# EAGLE design master-sim800-esp32-30pin (EAGLE 9.6.2)
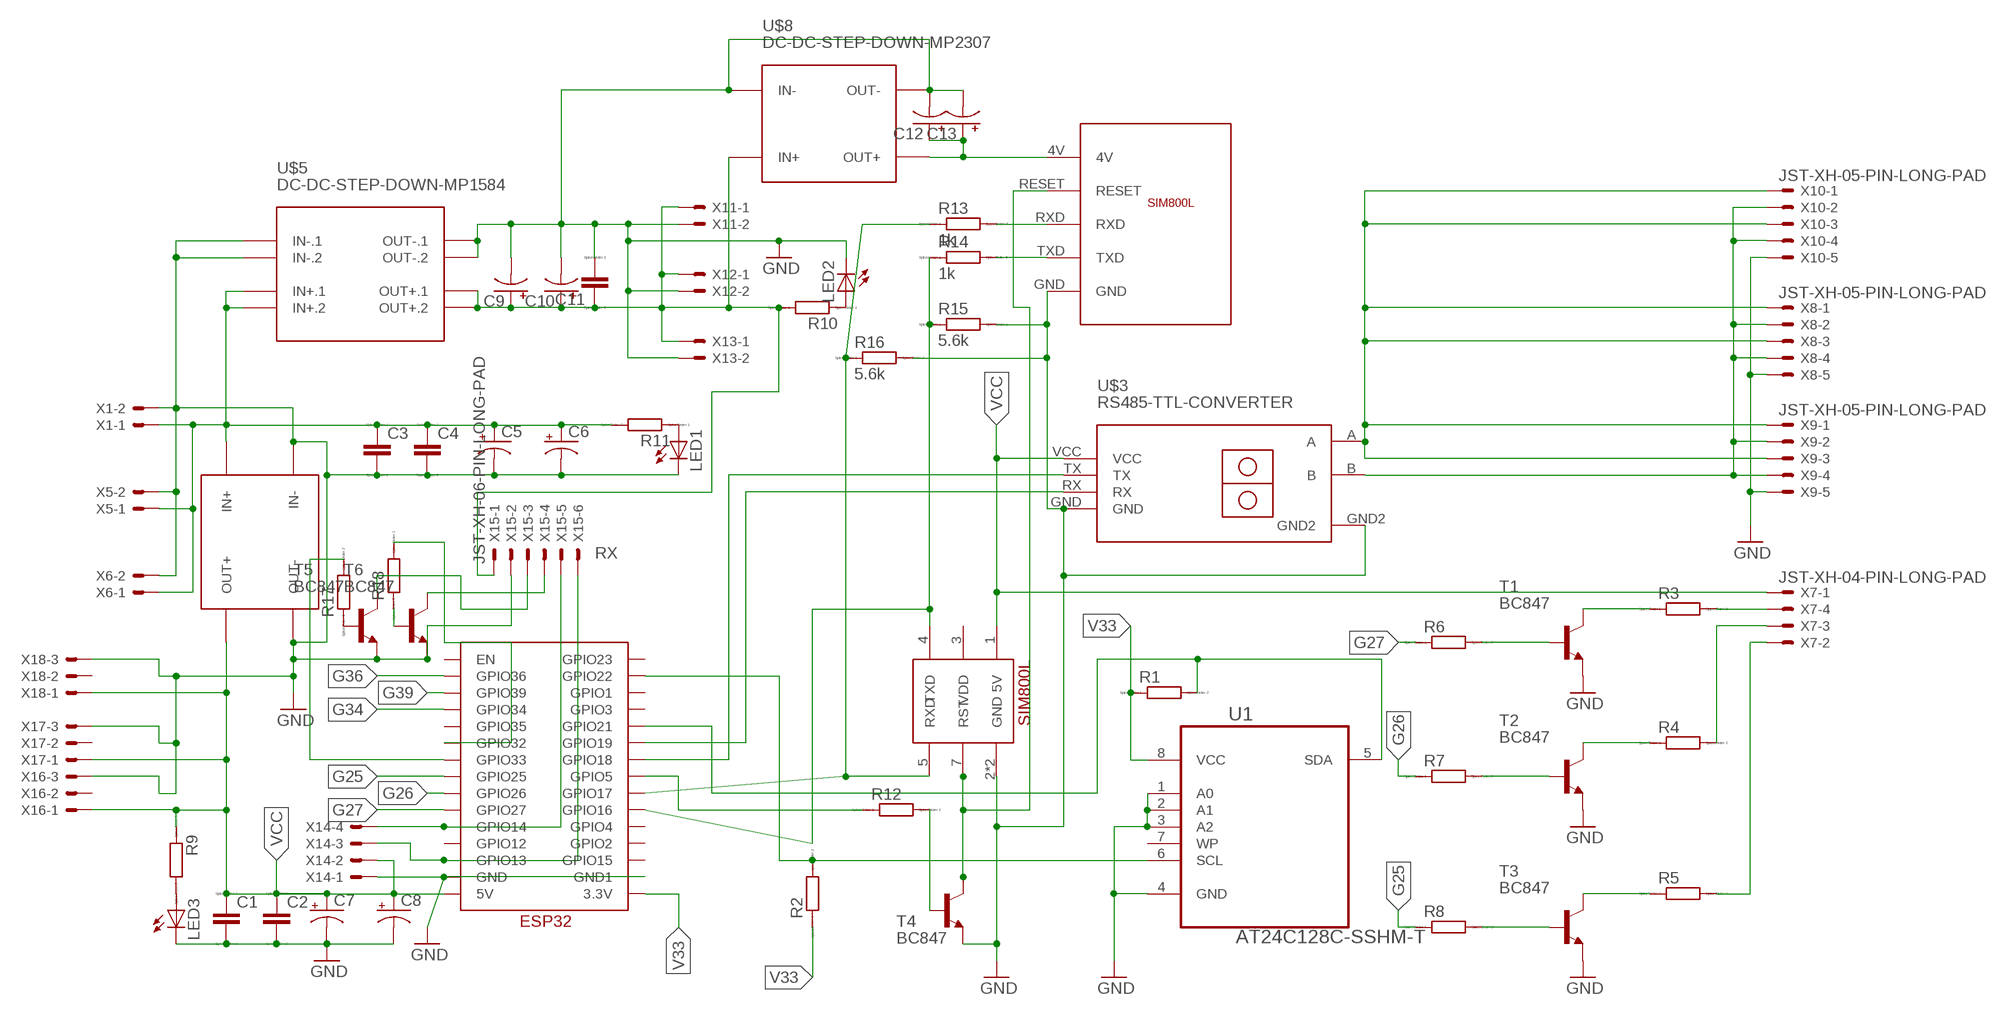
[diagram p0: schematic, sheet 1]

## Parts
C1  C  [C0805]
C2  C  [C0805]
C3  C  [C0805]
C4  C  [C0805]
C5  CPOL-USE5-8.5  [E5-8,5]
C6  CPOL-USE5-8.5  [E5-8,5]
C7  CPOL-USE5-8.5  [E5-8,5]
C8  CPOL-USE5-8.5  [E5-8,5]
C9  CPOL-USE5-6  [E5-6]
C10  CPOL-USE5-6  [E5-6]
C11  C  [C0805]
C12  CPOL-USE5-8.5  [E5-8,5]
C13  CPOL-USE5-8.5  [E5-8,5]
LED1  LEDCHIPLED_1206  [CHIPLED_1206]
LED2  LEDCHIPLED_1206  [CHIPLED_1206]
LED3  LEDCHIPLED_1206  [CHIPLED_1206]
R1  RR1206  [R1206]
R2  RR1206  [R1206]
R3  RR1206  [R1206]
R4  RR1206  [R1206]
R5  RR1206  [R1206]
R6  RR1206  [R1206]
R7  RR1206  [R1206]
R8  RR1206  [R1206]
R9  RR1206  [R1206]
R10  RR1206  [R1206]
R11  RR1206  [R1206]
R12  RR1206  [R1206]
R13  1k  RR1206  [R1206]
R14  1k  RR1206  [R1206]
R15  5.6k  RR1206  [R1206]
R16  5.6k  RR1206  [R1206]
R17  RR1206  [R1206]
R18  RR1206  [R1206]
T1  BC847  [SOT23]
T2  BC847  [SOT23]
T3  BC847  [SOT23]
T4  BC847  [SOT23]
T5  BC847  [SOT23]
T6  BC847  [SOT23]
U1  AT24C128C-SSHM-T  [SOIC127P600X175-8N]
U$1  ESP32-30PIN  [ESP32-30PIN]
U$2  SIM800L  [SIP]
U$3  RS485-TTL-CONVERTER  [RS485-TTL-CONVERTER]
U$4  DC-DC-STEP-DOWN-MP2307  [DC-DC-STEP-DOWN-MP2307]
U$5  DC-DC-STEP-DOWN-MP1584  [DC-DC-STEP-DOWN-MP1584]
U$7  SIM800L-V1  [SIM800L]
U$8  DC-DC-STEP-DOWN-MP2307  [DC-DC-STEP-DOWN-MP2307]
X1  JST-XH-02-PIN-LONG-PAD  [JST-XH-02-PACKAGE-LONG-PAD]
X5  JST-XH-02-PIN-LONG-PAD  [JST-XH-02-PACKAGE-LONG-PAD]
X6  JST-XH-02-PIN-LONG-PAD  [JST-XH-02-PACKAGE-LONG-PAD]
X7  JST-XH-04-PIN-LONG-PAD  [JST-XH-04-PACKAGE-LONG-PAD]
X8  JST-XH-05-PIN-LONG-PAD  [JST-XH-05-PACKAGE-LONG-PAD]
X9  JST-XH-05-PIN-LONG-PAD  [JST-XH-05-PACKAGE-LONG-PAD]
X10  JST-XH-05-PIN-LONG-PAD  [JST-XH-05-PACKAGE-LONG-PAD]
X11  JST-XH-02-PIN-LONG-PAD  [JST-XH-02-PACKAGE-LONG-PAD]
X12  JST-XH-02-PIN-LONG-PAD  [JST-XH-02-PACKAGE-LONG-PAD]
X13  JST-XH-02-PIN-LONG-PAD  [JST-XH-02-PACKAGE-LONG-PAD]
X14  JST-XH-04-PIN-LONG-PAD  [JST-XH-04-PACKAGE-LONG-PAD]
X15  JST-XH-06-PIN-LONG-PAD  [JST-XH-06-PACKAGE-LONG-PAD]
X16  JST-XH-03-PIN-LONG-PAD  [JST-XH-03-PACKAGE-LONG-PAD]
X17  JST-XH-03-PIN-LONG-PAD  [JST-XH-03-PACKAGE-LONG-PAD]
X18  JST-XH-03-PIN-LONG-PAD  [JST-XH-03-PACKAGE-LONG-PAD]

## Nets
G25: R8.1 U$1.GPIO25
G26: R7.1 U$1.GPIO26
G27: R6.1 U$1.GPIO27
G34: U$1.GPIO34
G36: U$1.GPIO36
G39: U$1.GPIO39
GND: C1.2 C2.2 C3.2 C4.2 C5.- C6.- C7.- C8.- C9.- C10.- C11.2 C12.- C13.- LED1.C LED2.C LED3.C R15.2 R16.2 T1.2(E) T2.2(E) T3.2(E) T4.2(E) T5.2(E) T6.2(E) U1.1(A0) U1.2(A1) U1.3(A2) U1.4(GND) U$1.GND U$1.GND1 U$2.2(GND) U$2.6(GND) U$3.GND U$3.GND2 U$4.IN- U$4.OUT- U$5.IN-.1 U$5.IN-.2 U$5.OUT-.1 U$5.OUT-.2 U$7.GND U$8.IN- U$8.OUT- X1.2 X5.2 X6.2 X8.5 X9.5 X10.5 X11.2 X12.2 X13.2 X14.1 X15.2 X16.3 X17.3 X18.3
N$1: C3.1 C4.1 C5.+ C6.+ R11.2 U$4.IN+ U$5.IN+.1 U$5.IN+.2 X1.1 X5.1 X6.1
N$2: R2.2 U1.6(SCL) U$1.GPIO22
N$3: R14.1 R15.1 U$1.GPIO16 U$2.4(TXD)
N$4: R13.1 R16.1 U$1.GPIO17 U$2.5(RXD)
N$5: U$3.A X8.1 X8.3 X9.1 X9.3 X10.1 X10.3
N$6: U$1.GPIO18 U$3.TX
N$7: U$1.GPIO19 U$3.RX
N$8: R1.2 U1.5(SDA) U$1.GPIO21
N$9: R3.1 T1.3(C)
N$10: R4.1 T2.3(C)
N$11: R5.1 T3.3(C)
N$12: R3.2 X7.4
N$13: R4.2 X7.3
N$14: R5.2 X7.2
N$15: R6.2 T1.1(B)
N$16: R7.2 T2.1(B)
N$17: R8.2 T3.1(B)
N$18: T4.3(C) U$2.7(RST) U$7.RESET
N$19: U$3.B X8.2 X8.4 X9.2 X9.4 X10.2 X10.4
N$20: LED3.A R9.2
N$21: LED2.A R10.1
N$22: LED1.A R11.1
N$23: C9.+ C10.+ C11.1 R10.2 U$5.OUT+.1 U$5.OUT+.2 U$8.IN+ X11.1 X12.1 X13.1 X15.1
N$24: R12.1 U$1.GPIO5
N$25: R12.2 T4.1(B)
N$26: R13.2 U$7.RXD
N$27: R14.2 U$7.TXD
N$28: C12.+ C13.+ U$7.4V U$8.OUT+
N$30: U$1.GPIO13 X14.3 X15.6
N$31: U$1.GPIO14 X14.4 X15.5
N$32: R17.1 T5.1(B)
N$33: R18.1 T6.1(B)
N$34: R18.2 U$1.GPIO32
N$35: T6.3(C) X15.4
N$36: T5.3(C) X15.3
N$37: R17.2 U$1.GPIO33
V33: R1.1 R2.1 U1.8(VCC) U$1.3.3V
VCC: C1.1 C2.1 C7.+ C8.+ R9.1 U$1.5V U$2.1(5V) U$3.VCC U$4.OUT+ X7.1 X14.2 X16.1 X17.1 X18.1
Unconnected: U1.7(WP) U$1.EN U$1.GPIO1 U$1.GPIO2 U$1.GPIO3 U$1.GPIO4 U$1.GPIO12 U$1.GPIO15 U$1.GPIO23 U$1.GPIO35 U$2.3(VDD) X16.2 X17.2 X18.2

## Notes on the sheet
- RX

## Library data of the parts
C1-C4 C11 = eagle-ltspice:C: CAPACITOR, European symbol; SPICEMODEL: NONE; SPICEPREFIX: C
C5-C10 C12 C13 = adafruit:CPOL-US: POLARIZED CAPACITOR, American symbol
LED1-LED3 = adafruit:LED: LED OSRAM: - CHIPLED LG R971, LG N971, LY N971, LG Q971, LY Q971, LO R971, LY R971 LH N974, LH R974 LS Q976, LO Q976, LY Q976 LO Q996 - Hyper CHIPLED LW Q18S LB Q993, LB Q99A, LB R99A - SideLED LS A670, LO A670, LY A670, LG A670, LP A670 LB A673, LV A673, LT A673, LW A673 LH A674 LY A675 LS A676, LA A676, LO A676, LY A676, LW A676 LS A679, LY A679, LG A679 - Hyper Micro SIDELED® LS Y876, LA Y876, LO Y876, LY Y876 LT Y87S - SmartLED LW L88C, LW L88S LB L89C, LB L89S, LG L890 LS L89K, LO L89K, LY L89K LS L896, LA L896, LO L896, LY L896 - TOPLED LS T670, LO T670, LY T670, LG T670, LP T670 LSG T670, LSP T670, LSY T670, LOP T670, LYG T670 LG T671, LOG T671, LSG T671 LB T673, LV T673, LT T673, LW T673 LH T674 LS T676, LA T676, LO T676, LY T676, LB T676, LH T676, LSB T676, LW T676 LB T67C, LV T67C, LT T67C, LS T67K, LO T67K, LY T67K, LW E67C LS E67B, LA E67B, LO E67B, LY E67B, LB E67C, LV E67C, LT E67C LW T67C LS T679, LY T679, LG T679 LS T770, LO T770, LY T770, LG T770, LP T770 LB T773, LV T773, LT T773, LW T773 LH T774 LS E675, LA E675, LY E675, LS T675 LS T776, LA T776, LO T776, LY T776, LB T776 LHGB T686 LT T68C, LB T68C - Hyper Mini TOPLED® LB M676 - Mini TOPLED Santana® LG M470 LS M47K, LO M47K, LY M47K Source: http://www.osram.convergy.de/
R1-R18 = eagle-ltspice:R: RESISTOR, European symbol; SPICEMODEL: NONE; SPICEPREFIX: R
T1-T6 = transistor:BC847: NPN TRANSISTOR
U1 = AT24C128C-SSHM-T:AT24C128C-SSHM-T: Two-wire Serial EEPROM Check prices <https://pricing.snapeda.com/parts/AT24C128C-SSHM-T/Microchip/view-part?ref=eda>; AVAILABILITY: Not in stock; DESCRIPTION: EEPROM Memory IC 128Kb (16K x 8) I²C 1MHz 550ns 8-SOIC; MF: Microchip; MP: AT24C128C-SSHM-T; PACKAGE: SO-8 Microchip; PRICE: None
U$1 = ESP32:ESP32-30PIN
U$2 = SIM800L:SIM800L: SIM800L Blue EVB Board with Level Translation and diode dropper.
U$3 = zort-library:RS485-TTL-CONVERTER: RS485 to TTL converter based on MAX485 chip
U$4 U$8 = diy-modules:DC-DC-STEP-DOWN-MP2307: DC/DC Step-Down Regulator based on MP2307DN chip MP2307 datasheet available here: https://cdn-shop.adafruit.com/datasheets/MP2307_r1.9.pdf Click here to find device on ebay.com <http://www.ebay.com/sch/dc+dc+3a+mini+converter>
U$5 = diy-modules:DC-DC-STEP-DOWN-MP1584: DC/DC Step-Down Regulator based on MP1584 chip MP1584 datasheet available here: http://www.haoyuelectronics.com/Attachment/MP1584/MP1584.pdf Click here to find device on ebay.com <http://www.ebay.com/sch/mp1584+module>
U$7 = SIM800L:SIM800L-V1
X1 X5 X6 X11-X13 = Rembrandt Electronics - JST XH Connectors v1-0:JST-XH-02-PIN: JST XH Connector 2 Pin Wire to board connector. Pitch: 2,54 mm, (0.100") Number of pins: 2 Created by Rembrandt Electronics www.rembrandtelectronics.com
X7 X14 = Rembrandt Electronics - JST XH Connectors v1-0:JST-XH-04-PIN: JST XH Connector 2 Pin Wire to board connector. Pitch: 2,54 mm, (0.100") Number of pins: 4 Created by Rembrandt Electronics www.rembrandtelectronics.com
X8-X10 = Rembrandt Electronics - JST XH Connectors v1-0:JST-XH-05-PIN: JST XH Connector 2 Pin Wire to board connector. Pitch: 2,54 mm, (0.100") Number of pins: 5 Created by Rembrandt Electronics www.rembrandtelectronics.com
X15 = Rembrandt Electronics - JST XH Connectors v1-0:JST-XH-06-PIN: JST XH Connector 2 Pin Wire to board connector. Pitch: 2,54 mm, (0.100") Number of pins: 6 Created by Rembrandt Electronics www.rembrandtelectronics.com
X16-X18 = Rembrandt Electronics - JST XH Connectors v1-0:JST-XH-03-PIN: JST XH Connector 2 Pin Wire to board connector. Pitch: 2,54 mm, (0.100") Number of pins: 3 Created by Rembrandt Electronics www.rembrandtelectronics.com

## Board
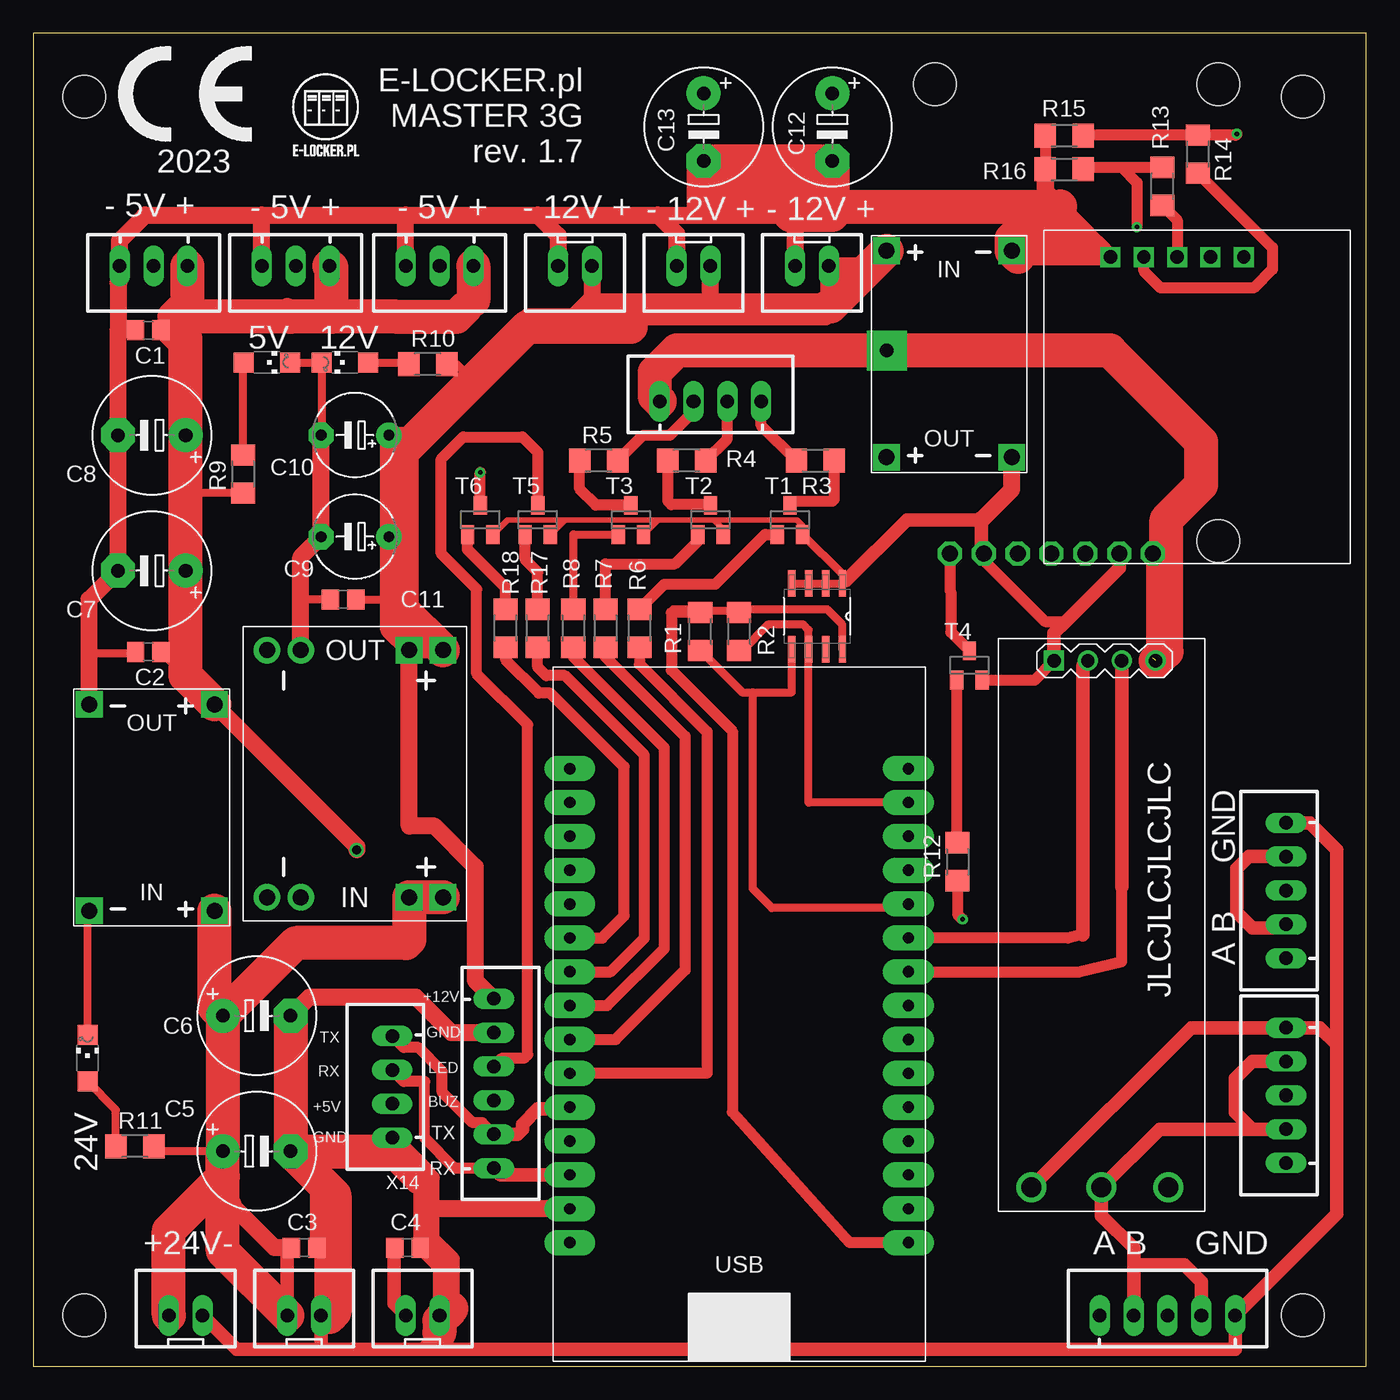
[diagram p1: board, top side]
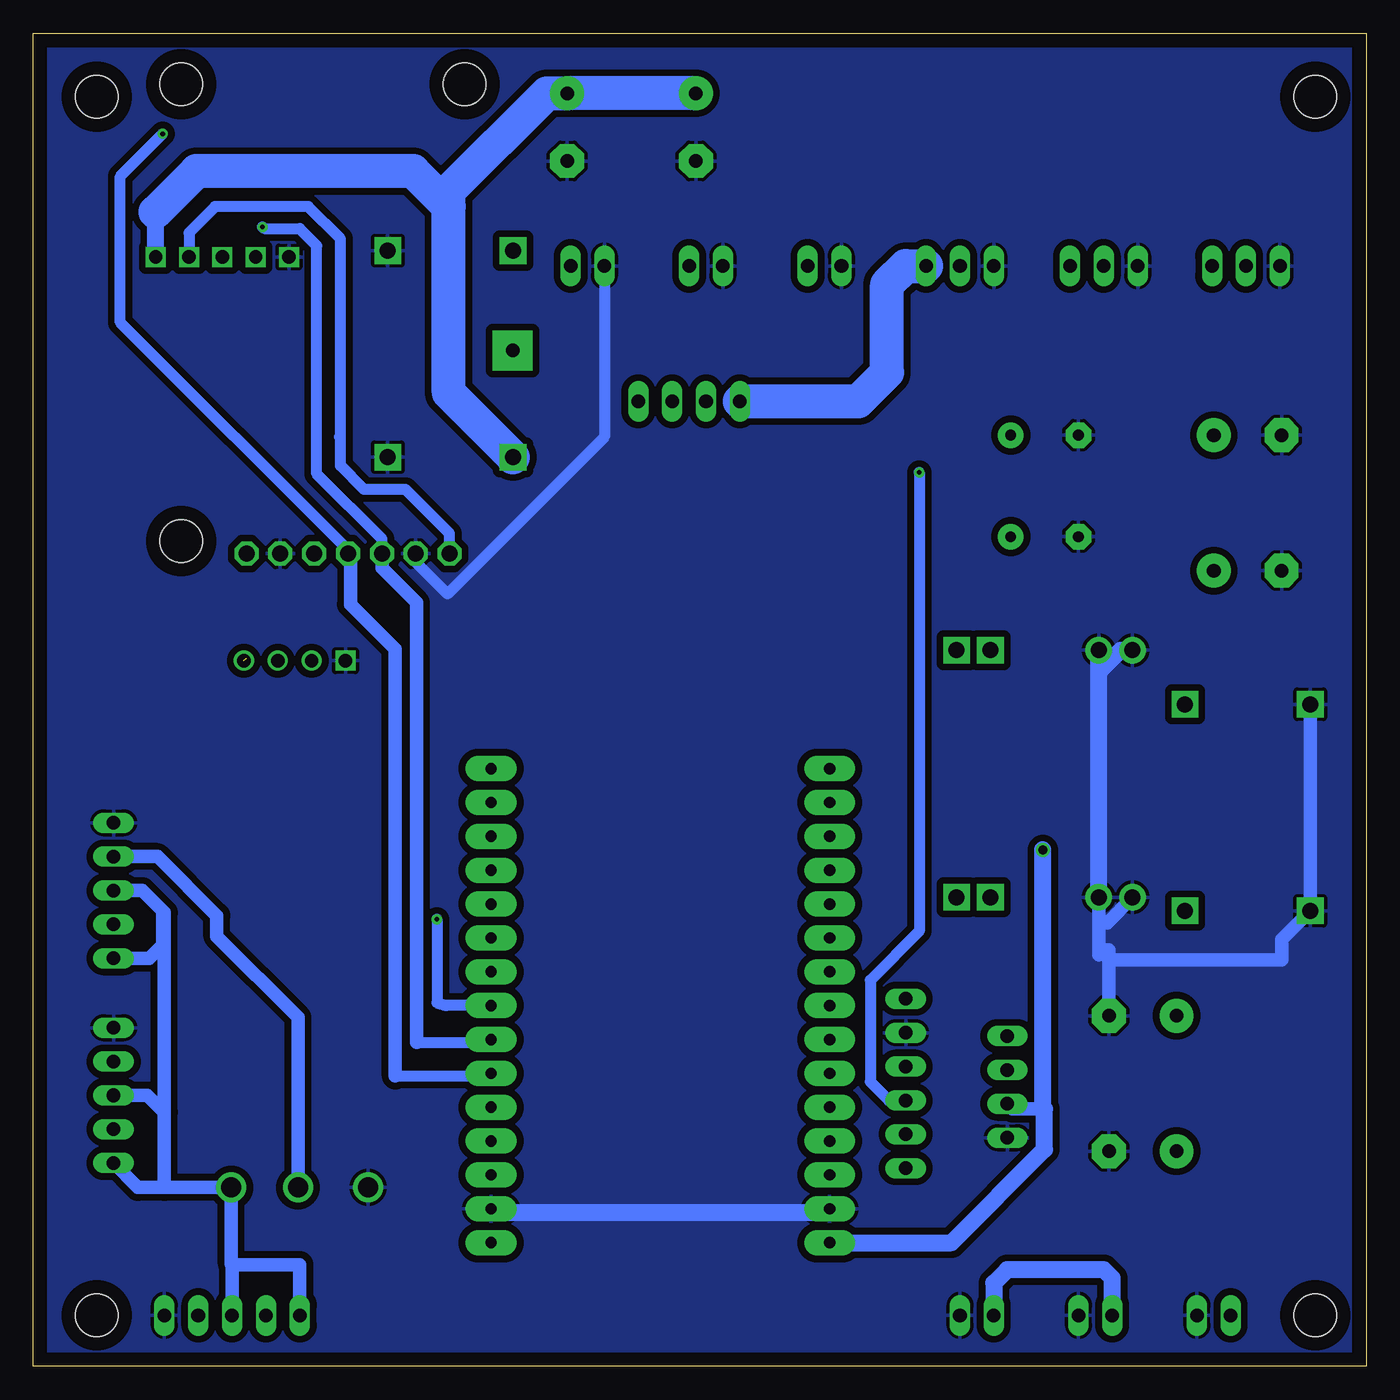
[diagram p2: board, bottom side, seen from below]

Size 100 x 100 mm. Coordinates in mm from the lower left corner, seen from the top.
Outline: 0,0 100,0 100,100 0,100 0,0
Copper layers (1*16): Top 0.035mm / dielectric 1.5mm / Bottom 0.035mm
Design rules "default *": minimum track width 10mil, minimum drill 0.35mm, track to track 20mil, track to pad 20mil, pad to pad 20mil, via to via 20mil, smd to smd 6mil, copper to edge 40mil, drill to drill 6mil, minimum pad ring 10mil, minimum via ring 8mil, stop-mask expansion 4mil, vias tented up to drill 0mil, thermal gap 10mil
Holes 3.2 mm at 3.81,95.25 95.25,95.25 95.25,3.81 3.81,3.81

### Footprints (pad centres in the part's own frame; a part is rotated, then mirrored left to right if it is on the bottom)
C0805 = smd 1.3 x 1.5: 1 -0.95,0; 2 0.95,0
E5-8,5 = drill 1.016 pad 2.54: + -2.54,0 | drill 1.016 pad 2.54 octagon: - 2.54,0
E5-6 = drill 0.813 pad 1.905: + -2.54,0 | drill 0.813 pad 1.905 octagon: - 2.54,0
CHIPLED_1206 = smd 1.5 x 1.5: A 0,-1.75; C 0,1.75
R1206 = smd 1.6 x 1.803: 1 -1.422,0; 2 1.422,0
SOT23 = smd 1 x 1.4: 1 -0.95,-1.1; 2 0.95,-1.1; 3 0,1.1
SOIC127P600X175-8N = smd 1.981 x 0.559: 1 -2.464,1.905; 2 -2.464,0.635; 3 -2.464,-0.635; 4 -2.464,-1.905; 5 2.464,-1.905; 6 2.464,-0.635; 7 2.464,0.635; 8 2.464,1.905
ESP32-30PIN = drill 0.85 pad 1.93 long: 3.3V 26.67,1.27; 5V 1.27,1.27; EN 1.27,36.83; GND 1.27,3.81; GND1 26.67,3.81; GPIO1 26.67,31.75; GPIO2 26.67,8.89; GPIO3 26.67,29.21; GPIO4 26.67,11.43; GPIO5 26.67,19.05; GPIO12 1.27,8.89; GPIO13 1.27,6.35; GPIO14 1.27,11.43; GPIO15 26.67,6.35; GPIO16 26.67,13.97; GPIO17 26.67,16.51; GPIO18 26.67,21.59; GPIO19 26.67,24.13; GPIO21 26.67,26.67; GPIO22 26.67,34.29; GPIO23 26.67,36.83; GPIO25 1.27,19.05; GPIO26 1.27,16.51; GPIO27 1.27,13.97; GPIO32 1.27,24.13; GPIO33 1.27,21.59; GPIO34 1.27,29.21; GPIO35 1.27,26.67; GPIO36 1.27,34.29; GPIO39 1.27,31.75
SIP = drill 1.2 octagon: 1 38.1,19.24; 2 38.1,16.7; 3 38.1,14.16; 4 38.1,11.62; 5 38.1,9.08; 6 38.1,6.54; 7 38.1,4 | hole 3.2: 2.87,24.13; 2.87,2.87; 37.16,24.13
RS485-TTL-CONVERTER = drill 1.5: A 41.2,12.75; B 41.2,7.75; GND2 41.2,2.5 | drill 1 square: GND 1.68,4.19 | drill 1: RX 1.68,6.73; TX 1.68,9.27; VCC 1.68,11.81
DC-DC-STEP-DOWN-MP2307 = drill 1.2 pad 2 square: IN+ -7.747,-4.699; IN- -7.747,4.699; OUT+ 7.747,-4.699; OUT- 7.747,4.699
DC-DC-STEP-DOWN-MP1584 = drill 1.2 pad 2 square: IN+.1 -9.271,-4.064; IN+.2 -9.271,-6.604; OUT+.1 9.271,-4.064; OUT+.2 9.271,-6.604 | drill 1.2 pad 2: IN-.1 -9.271,6.604; IN-.2 -9.271,4.064; OUT-.1 9.271,6.604; OUT-.2 9.271,4.064
SIM800L = drill 1 square: 4V 2,15; GND 2,5; RESET 2,12.5; RXD 2,10; TXD 2,7.5
JST-XH-02-PACKAGE-LONG-PAD = drill 1.016 long: 1 -1.27,0; 2 1.27,0
JST-XH-04-PACKAGE-LONG-PAD = drill 1.016 long: 1 -3.81,0; 2 -1.27,0; 3 1.27,0; 4 3.81,0
JST-XH-05-PACKAGE-LONG-PAD = drill 1.016 long: 1 -5.08,0; 2 -2.54,0; 3 0,0; 4 2.54,0; 5 5.08,0
JST-XH-06-PACKAGE-LONG-PAD = drill 1.016 long: 1 -6.35,0; 2 -3.81,0; 3 -1.27,0; 4 1.27,0; 5 3.81,0; 6 6.35,0
JST-XH-03-PACKAGE-LONG-PAD = drill 1.016 long: 1 -2.54,0; 2 0,0; 3 2.54,0

### Placement (x,y rotation side)
C1  8.64,77.72 180 top
C2  8.64,53.59 180 top
C3  20.32,8.89 0 top
C4  28.07,8.89 0 top
C5  16.76,16.13 0 top
C6  16.76,26.29 0 top
C7  8.89,59.69 180 top
C8  8.89,69.85 180 top
C9  24.13,62.23 180 top
C10  24.13,69.85 180 top
C11  23.24,57.53 180 top
C12  59.94,92.96 270 top
C13  50.29,92.96 270 top
LED1  4.06,23.11 0 top
LED2  23.37,75.31 90 top
LED3  17.53,75.31 270 top
R1  50.04,55.12 270 top
R2  52.96,55.12 270 top
R3  58.67,67.94 180 top
R4  49.02,67.94 0 top
R5  42.42,67.94 0 top
R6  45.47,55.37 90 top
R7  42.93,55.37 90 top
R8  40.51,55.37 90 top
R9  15.75,66.93 90 top
R10  29.59,75.18 0 top
R11  7.62,16.51 0 top
R12  69.34,37.85 90 top
R13  84.71,88.52 270 top
R14  87.38,90.93 270 top
R15  77.34,92.33 180 top
R16  77.34,89.79 180 top
R17  37.85,55.37 270 top
R18  35.43,55.37 270 top
T1  56.77,63.5 0 top
T2  50.8,63.5 0 top
T3  44.83,63.5 0 top
T4  70.23,52.58 0 top
T5  37.85,63.5 0 top
T6  33.53,63.5 0 top
U1  58.8,56.26 270 top
U$1  38.99,8 0 top
U$2  64.77,99.06 270 top
U$3  72.39,54.61 270 top
U$4  8.89,41.91 90 top
U$5  24.13,44.45 90 top
U$6  [ELOCKER]  19.43,90.55 0 top
U$7  75.82,85.22 270 top
U$8  68.71,75.95 270 top
U$9  [CE_7.3MM]  6.35,91.82 0 top
X1  11.43,3.81 0 top
X5  20.32,3.81 0 top
X6  29.21,3.81 0 top
X7  50.8,72.39 0 top
X8  93.98,20.32 90 top
X9  93.98,35.69 90 top
X10  85.09,3.81 0 top
X11  40.64,82.55 180 top
X12  49.53,82.55 180 top
X13  58.42,82.55 180 top
X14  26.92,20.95 90 top
X15  34.54,21.21 270 top
X16  9.02,82.55 180 top
X17  30.48,82.55 180 top
X18  19.68,82.55 180 top

### Tracks (layer width: path | path; a pad name or v marks a point on that pad's centre or on a via)
G25
  Top 0.813: R8.1 40.51,53.21 47.32,46.41 47.32,31.32 43.05,27.05 U$1.GPIO25
G26
  Top 0.813: R7.1 42.93,53.21 48.9,47.24 48.9,29.72 43.69,24.51 U$1.GPIO26
G27
  Top 0.813: R6.1 45.47,52.68 50.55,47.6 50.55,21.97 U$1.GPIO27
GND
  Top 0.406: T3.2 46.88,63.5 | 46.88,63.5 51.05,63.5 | 51.05,63.5 51.75,62.8 T2.2 | 51.05,63.5 57.28,63.5 57.72,63.06 T1.2 | T5.2 39.9,63.5 | 39.9,63.5 46.88,63.5 | T6.2 35.58,63.5 39.9,63.5
  Top 0.61: U1.4 U1.3 U1.2 U1.1 | 60.96,58.93 60.91,58.93 U1.1 | C2.2 7.56,53.47 4.19,53.47 | LED1.C 4.06,34.04 U$4.IN- | C11.2 20.07,57.53 | LED3.C LED2.C 21.62,69.88 C10.- | T1.2 60.71,59.41 U1.1 | X14.1 26.92,16.76 26.67,16.51
  Top 0.813: T4.2 75.13,51.48 U$3.GND | 56.77,86.36 56.13,86.36 | U$2.6 71.31,60.45 75.88,55.88 77.47,55.88 | R15.2 R16.2
  Top 1.016: C5.- 19.3,15.55 21.27,13.59 C3.2 21.59,8.57 X5.2 21.59,1.27 | 29.02,14.16 C4.2 30.48,7.43 X6.2 30.48,2.54 29.21,1.27 | X1.2 15.24,1.27 21.59,1.27 | 21.59,1.27 29.21,1.27 | 29.21,1.27 90.17,1.27 X10.5 97.79,11.43 97.79,24.13 | 97.79,24.13 96.52,25.4 X8.5 86.88,25.4 U$3.GND2 | U$3.GND 76.58,54.99 77.47,55.88 81.47,59.88 U$2.2 | U$2.6 71.12,61.15 71.12,63.5 65.53,63.5 60.96,58.93 | 97.79,24.13 97.79,38.73 95.76,40.77 X9.5
  Top 1.27: U$4.OUT- 4.19,53.47 4.19,57.53 C7.- C8.- 6.35,77.72 | 6.35,77.72 6.35,81.28 6.48,81.41 X16.3 6.48,84.45 8.38,86.36 17.14,86.36 | C1.2 6.35,77.72 | U$5.OUT-.2 20.07,57.53 20.07,60.71 C9.- C10.- | X11.2 39.37,84.84 37.85,86.36 | 37.85,86.36 46.86,86.36 | X12.2 48.26,84.96 46.86,86.36 | 46.86,86.36 56.13,86.36 57.15,85.34 X13.2 | 71.12,63.5 73.41,65.79 U$8.OUT- | X6.2 31.37,4.7 31.37,8 29.84,9.53 29.84,11.81 | 29.84,11.81 29.84,14.1 29.78,14.16 29.02,14.16 | U$7.GND 78.07,83.22 | 78.07,83.22 76.71,84.58 | 78.07,83.22 74.45,83.22 | 73.88,83.22 74.45,83.22 | 74.45,83.22 75.44,84.2 79.83,84.2 U$7.GND | U$7.GND 77.34,86.69 77.34,86.75 75.93,88.16 75.93,89.78 R16.2 75.92,88.11 77.04,87 | X15.2 31.37,25.02 28.7,27.69 20.7,27.69 C6.- | 17.14,86.36 27.94,86.36 | 27.94,86.36 37.85,86.36 | X18.3 17.14,86.36 | X17.3 27.94,86.36 | U$1.GND 29.84,11.81
  Top 2.54: C5.- 22.61,12.83 22.61,4.06 22.23,3.68 | C5.- 27.05,16.13 | 26.67,16.51 27.05,16.13 | 27.05,16.13 29.02,14.16 | 31.37,4.32 30.48,3.43 30.48,2.54 | C6.- C5.- | 73.88,83.22 U$8.IN- 73.41,84.58 75.06,86.23 76.71,84.58 77.34,84.58 77.72,84.96 | 59.94,87 77.04,87 | 56.77,86.36 59.94,86.36 59.94,87 | 59.94,87 C12.- C13.- 50.29,87.12 59.31,87.12 59.31,88.52 58.93,88.9 51.31,88.9
  Bottom 0.813: X13.2 57.15,69.72 68.93,57.94 71.31,60.33 U$2.6
  Bottom 1.016: 20.07,33.27 20.07,30.86 19.68,31.24 19.3,31.24 19.3,30.48 | 20.07,33.27 U$5.IN-.2 | 20.07,33.27 19.43,33.27 U$5.IN-.1 | C6.- 19.3,30.48 | 19.3,30.48 6.35,30.48 6.35,32 U$4.IN- U$4.OUT-
  Bottom 1.27: U$5.IN-.2 20.07,52.07 | 20.07,52.07 U$5.OUT-.2 | 20.07,52.07 18.41,53.72 U$5.OUT-.1 | U$1.GND1 65.41,11.56 40.01,11.56 U$1.GND
  pour Bottom: 1.14,99.44 1.14,0.51 99.19,0.51 99.19,99.31 1.27,99.31
N$1
  Top 0.61: R11.2 9.42,16.13 C5.+ 14.22,12.95 14.99,12.19
  Top 1.016: C4.1 27.05,8.82 27.05,4.7 X6.1 | X5.1 19.05,8.57 C3.1
  Top 1.27: C3.1 18.1,8.89 14.99,12 14.99,12.19
  Top 2.54: X1.1 10.16,10.16 14.22,14.22 C5.+ | X5.1 14.22,8.64 C5.+ | C6.+ C5.+ | C6.+ 13.59,26.92 U$4.IN+ | U$5.IN+.2 U$5.IN+.1 28.19,32 27.94,31.75 19.68,31.75 C6.+
  Bottom 1.27: X5.1 19.05,6.6 19.68,7.24 26.92,7.24 27.94,6.22 X6.1
N$2
  Top 0.61: R2.2 53.19,53.7 55.12,55.63 57.78,55.63 58.17,55.24 U1.6 58.17,42.29 U$1.GPIO22
N$3  (via drill 0.35)
  Top 0.813: v90.3,92.46 90.19,92.35 R14.1 78.79,92.35 R15.1
  Bottom 0.813: v90.3,92.46 93.47,89.28 93.47,78.3 76.39,61.21 U$2.4 | 72.85,21.77 66.42,21.77 U$1.GPIO16
  Bottom 1.016: U$2.4 76.2,60.77 76.2,57.15 72.85,53.8 72.85,21.77
N$4  (via drill 0.35)
  Top 0.813: R16.1 78.92,89.94 81.66,89.94 | 81.66,89.94 R13.1 | 81.66,89.94 82.8,88.8 v82.8,85.47
  Bottom 0.813: U$2.5 73.85,62.07 78.73,66.95 78.73,84.06 80.01,85.34 82.68,85.34 v82.8,85.47 | 71.25,24.28 66.48,24.28 U$1.GPIO17
  Bottom 1.016: 71.25,24.28 71.25,57.28 73.85,59.88 U$2.5
N$5
  Bottom 1.016: X10.1 80.01,7.62 85.09,7.62 | 85.09,7.62 X10.3 | 85.09,7.62 85.14,7.67 U$3.A 90.17,13.41 | 90.17,13.41 92.15,13.41 X8.1 | 90.17,13.41 90.17,19.05 | 90.17,19.05 91.44,20.32 X8.3 | X9.3 91.82,35.69 90.3,34.16 | 90.3,34.16 90.3,31.62 91.31,30.61 X9.1 | 90.17,19.05 90.17,34.04 90.3,34.16
N$6
  Top 0.813: U$1.GPIO18 78.52,29.59 81.66,30.34 81.66,35.97
  Top 1.016: 81.66,35.97 U$3.TX
N$7
  Top 0.813: 78.74,32.36 78.57,32.36 77.65,32.13 U$1.GPIO19
  Top 1.016: 78.74,32.36 78.74,52.55 U$3.RX
N$8
  Top 0.61: U1.5 56.9,50.55 53.98,50.55 | 53.98,50.55 53.98,35.81 55.41,34.37 65.36,34.37 U$1.GPIO21 | R1.2 53.19,50.55 53.98,50.55
N$9
  Top 0.813: T1.3 57.07,64.9 59.94,64.9 60.1,65.05 R3.1
N$10
  Top 0.813: T2.3 50.76,64.64 47.88,64.64 47.6,64.92 R4.1
N$11
  Top 0.813: T3.3 42.21,64.6 41,65.81 R5.1
N$12
  Top 0.813: R3.2 54.61,70.59 X7.4
N$13
  Top 0.813: R4.2 52.07,69.57 X7.3
N$14
  Top 0.813: R5.2 45.74,69.85 47.75,69.85 49.53,71.63 X7.2
N$15
  Top 0.813: R6.2 47.35,58.67 51.18,58.67 54.91,62.4 T1.1
N$16
  Top 0.813: R7.2 42.93,60.2 48.13,60.2 49.85,61.91 T2.1
N$17
  Top 0.61: R8.2 40.51,62.4 T3.1
N$18
  Top 0.813: U$2.7 68.77,58.17 68.83,58.1 68.83,55.08 T4.3
  Bottom 0.813: 68.77,61.47 U$2.7 68.77,62.48 72.07,65.79 75.18,65.79 76.96,67.56 76.96,69.72 | 77.03,69.72 76.96,69.72 | 76.96,69.72 76.96,84.58 79.38,87 86.36,87 88.32,85.04 U$7.RESET
N$19
  Top 1.016: X10.2 82.55,7.62 | 82.55,7.62 82.55,8.89 80.14,11.3 U$3.B 84.51,17.78 X8.2 91.44,17.78 90.17,19.05 90.17,21.59 91.44,22.86 X8.4 | X10.4 87.63,6.35 86.36,7.62 82.55,7.62 | X9.4 91.19,38.23 90.3,37.34 90.3,34.04 91.44,32.89 93.73,32.89 X9.2
  Bottom 1.016: U$3.B 80.14,26.16 86.23,32.26 86.23,33.78 90.68,38.23 X9.4
N$20
  Top 0.61: R9.2 15.75,75.28 LED3.A
N$21
  Top 0.61: LED2.A 28.04,75.31 R10.1
N$22
  Top 0.61: R11.1 6.2,19.23 LED1.A
N$23
  Top 0.61: C11.1 26.54,57.53 26.67,57.66 | R10.2 31.75,75.18 32.58,74.36 32.64,74.3
  Top 1.27: U$5.OUT+.2 U$5.OUT+.1 | U$5.OUT+.1 26.67,55.24 26.67,57.66 C9.+ C10.+ 28.07,69.85 32.58,74.36 | 32.64,74.3 37.08,78.74 40.51,78.74 | 40.51,78.74 41.91,80.14 | X11.1 41.91,80.14 | 40.51,78.74 49.4,78.74 | 49.4,78.74 50.8,80.14 X12.1 | 49.4,78.74 59.44,78.74 59.69,78.99 59.69,79.5 59.69,79.88 | 59.69,79.88 X13.1 62.87,82.55 U$8.IN+ | 41.91,80.14 42.16,79.88 59.69,79.88 | X15.1 33.15,28.96 33.15,37.47 30.1,40.51 28.19,40.51 U$5.OUT+.1
  Top 2.54: U$5.OUT+.2 27.69,56.77 27.69,68.58 37.08,77.98 44.83,77.98 | U$8.IN+ 59.82,79.5 59.69,79.5
N$24  (via drill 0.35)
  Top 0.813: R12.1 69.34,33.91 v69.72,33.53
  Bottom 0.813: U$1.GPIO5 69.03,27.05 69.72,27.26 v69.72,33.53
N$25
  Top 0.813: R12.2 69.28,39.33 T4.1
N$26
  Top 0.813: R13.2 85.82,85.99 U$7.RXD
N$27
  Top 0.813: R14.2 92.96,83.92 92.96,82.3 91.57,80.9 84.58,80.9 83.32,82.16 U$7.TXD
N$28
  Bottom 1.27: U$7.4V 90.82,86.6
  Bottom 2.54: 68.83,87 68.83,73.03 U$8.OUT+ | 68.83,87 71.5,89.66 87.76,89.66 90.82,86.6 | C13.+ C12.+ 61.47,95.5 68.83,88.14 68.83,87
N$29  (via drill 1 pad 3)
  other vias: 64.03,76.2
N$30
  Top 0.813: X15.6 31.62,14.86 29.36,17.12 29.36,21.36 27.79,21.36 X14.3
  Top 1.016: U$1.GPIO13 35.05,14.35 X15.6
N$31
  Top 0.813: X15.5 33.68,18.26 32.96,18.26 30.68,20.54 30.68,22.11 28.89,23.9 27.79,23.9 X14.4
  Top 1.016: U$1.GPIO14 40.13,19.3 37.85,19.3 36.7,18.16 36.7,17.78 36.32,17.4 X15.5
N$32
  Top 0.813: R17.1 37.85,59.56 36.9,60.51 T5.1
N$33
  Top 0.813: R18.1 35.43,58.42 32.58,61.27 T6.1
N$34
  Top 0.813: U$1.GPIO32 42.67,32.13 44.32,33.78 44.32,44.96 38.79,50.49 37.93,50.49 35.43,53 R18.2
N$35  (via drill 0.35)
  Top 0.813: T6.3 v33.53,67.06
  Bottom 0.813: v33.53,67.06 33.53,32.64 37.21,28.96 37.21,21.34 35.81,19.94 X15.4
N$36
  Top 0.813: X15.3 35.18,23.11 36.83,23.11 37.08,23.37 37.08,48.13 33.27,51.94 33.27,58.29 30.61,60.96 30.61,68.07 32.26,69.72 36.7,69.72 37.85,68.58 T5.3
N$37
  Top 0.813: U$1.GPIO33 43.31,29.59 45.85,32.13 45.85,45.85 39.88,51.82 38.48,51.82 37.85,52.45 R17.2
V33
  Top 0.61: U1.8 60.71,55.63 59.56,56.77 53.19,56.77 R2.1 52.96,56.64 50.04,56.64 | 48.01,56.77 50.04,56.77 50.04,56.64 | R1.1 50.04,56.64
  Top 0.813: U$1.3.3V 61.26,9.27 52.45,19.07 52.45,47.65 47.88,52.22 47.88,56.54 R1.1
VCC  (via drill 0.65)  (1 unrouted)
  Top 0.61: C2.1 13.52,49.66 U$4.OUT+ | R9.1 11.53,65.51 11.43,65.41
  Top 1.016: 84.2,60.77 U$2.1 84.01,53.12
  Top 1.27: C7.+ 11.43,65.41 C8.+ 11.43,75.88 C1.1 10.6,78.74 18.29,78.74 | 18.29,78.74 19.05,79.5 | 19.3,78.74 18.29,78.74 | 27.3,78.74 27.94,79.38 32.38,79.38 33.02,80.01 | U$4.OUT+ 24.26,38.99 v24.26,38.73 | 85.01,53.62 84.89,53.62 U$3.VCC
  Top 2.54: U$4.OUT+ 11.43,51.82 C7.+ C8.+ 11.43,77.09 10.92,77.6 | X7.1 46.61,72.77 46.61,74.55 48.26,76.2 80.77,76.2 87.63,69.34 87.63,66.13 85.01,63.51 85.01,53.62 84.33,52.93 U$3.VCC | 22.35,78.74 27.3,78.74 31.75,78.74 32.38,79.38 | 22.35,78.74 19.3,78.74 10.6,78.74 11.56,79.69 X16.1 | X17.1 33.02,80.01 | X18.1 22.35,82.42 22.35,78.74
  Bottom 1.016: X14.2 26.54,19.3 24.26,19.3 24.13,19.3
  Bottom 1.27: U$1.5V 31.11,9.27 24.13,16.26 24.13,19.3 | 24.26,19.3 v24.26,38.73
  Bottom 2.54: X7.1 38.1,72.39 35.94,74.55 35.94,81.15 34.54,82.55 X17.1

### Text on the board
tNames: E-LOCKER.pl / MASTER 3G / rev. 1.7 | 2023 | - 5V + | - 5V + | - 5V + | - 12V + | - 12V + | - 12V + | 5V | 12V | A B GND | JLCJLCJLCJLC | +12V | GND | TX | RX | LED | +5V | BUZ | GND | TX | 24V | RX | +24V- | A B GND